# Altium project VOLTAGE_MEASURE_DC.PrjPCB
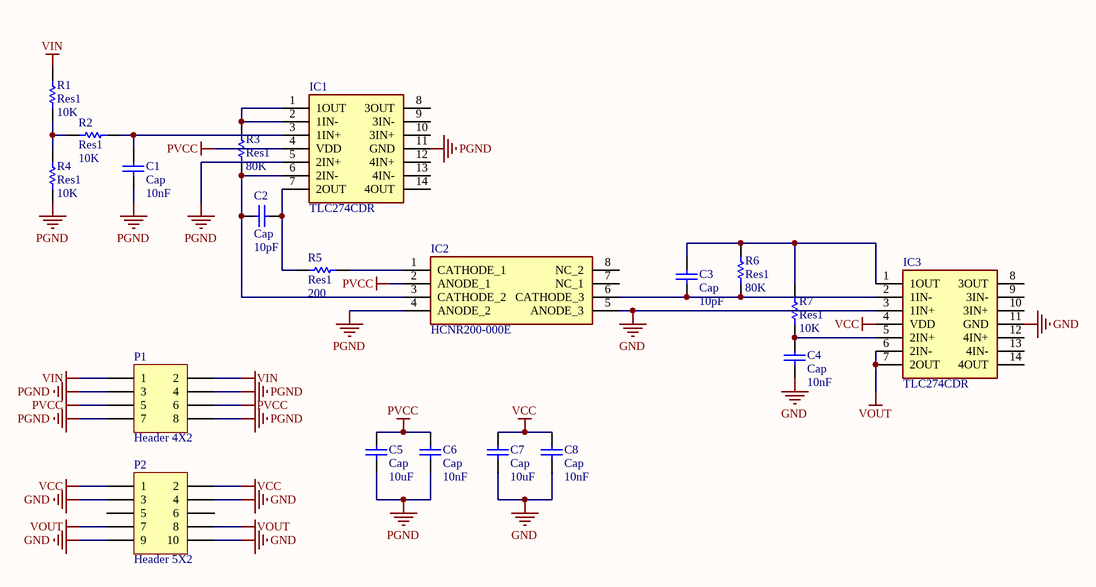
[diagram p0: VOLTAGE_MEASURE_DC.SchDoc]
1 sheet, 20 parts. Net scope: global (net labels, ports and power ports of the same name join across sheets).
Board file: VOLTAGE_MEASURE_DC.PcbDoc

## Sheet VOLTAGE_MEASURE_DC.SchDoc
size A4

### Parts
C1  Cap  value 10nF  [1608[0603]]
C2  Cap  value 10pF  [1608[0603]]
C3  Cap  value 10pF  [1608[0603]]
C4  Cap  value 10nF  [1608[0603]]
C5  Cap  value 10uF  [1608[0603]]
C6  Cap  value 10nF  [1608[0603]]
C7  Cap  value 10uF  [1608[0603]]
C8  Cap  value 10nF  [1608[0603]]
IC1  TLC274CDR  [SOIC127P600X175-14N]
IC2  HCNR200-000E  [DIP1100W56P254L1115H510Q8N]
IC3  TLC274CDR  [SOIC127P600X175-14N]
P1  Header 4X2  [HDR2X4]
P2  Header 5X2  [HDR2X5]
R1  Res1  value 10K  [J1-0603]
R2  Res1  value 10K  [J1-0603]
R3  Res1  value 80K  [J1-0603]
R4  Res1  value 10K  [J1-0603]
R5  Res1  value 200  [J1-0603]
R6  Res1  value 80K  [J1-0603]
R7  Res1  value 10K  [J1-0603]

### Nets
GND: C4.1 C7.2 C8.2 IC2.5(ANODE_3) IC3.3(1IN+) IC3.11(GND) P2.3 P2.4 P2.9 P2.10
PGND: C1.1 C5.2 C6.2 IC1.5(2IN+) IC1.11(GND) IC2.4(ANODE_2) P1.3 P1.4 P1.7 P1.8 R4.1
PVCC: C5.1 C6.1 IC1.4(VDD) IC2.2(ANODE_1) P1.5 P1.6
VCC: C7.1 C8.1 IC3.4(VDD) P2.1 P2.2
VIN: P1.1 P1.2 R1.2
VOUT: IC3.6(2IN-) IC3.7(2OUT) P2.7 P2.8
NetC1_2: C1.2 IC1.3(1IN+) R2.2
NetC2_1: C2.1 IC1.7(2OUT) R5.1
NetC2_2: C2.2 IC1.6(2IN-) IC2.3(CATHODE_2) R3.1
NetC3_1: C3.1 IC3.1(1OUT) R6.2 R7.1
NetC3_2: C3.2 IC2.6(CATHODE_3) IC3.2(1IN-) R6.1
NetC4_2: C4.2 IC3.5(2IN+) R7.2
NetIC1_1: IC1.1(1OUT) IC1.2(1IN-) R3.2
NetIC2_1: IC2.1(CATHODE_1) R5.2
NetR1_1: R1.1 R2.1 R4.2

Not connected (* = marked no-connect by the designer): IC1 8(3OUT) 9(3IN-) 10(3IN+) 12(4IN+) 13(4IN-) 14(4OUT); IC2 7(NC_1) 8(NC_2); IC3 8(3OUT) 9(3IN-) 10(3IN+) 12(4IN+) 13(4IN-) 14(4OUT); P2 5 6

### Library data of the parts
C1-C8 = Cap: Capacitor; Published: 8-Jun-2000; LatestRevisionDate: 17-Jul-2002; LatestRevisionNote: Re-released for DXP Platform.; PackageReference: RAD-0.3; Publisher: Altium Limited; PackageDescription: Radial Cap, Thru-Hole; 2 Leads; 0.3 in Pin Spacing
IC1 IC3 = TLC274CDR: Integrated Circuit; Manufacturer_Name: Texas Instruments; Datasheet Link: http://www.ti.com/lit/gpn/tlc274; Manufacturer_Part_Number: TLC274CDR; Mouser Part Number: 595-TLC274CDR; Mouser Price/Stock: https://www.mouser.com/Search/Refine.aspx?Keyword=595-TLC274CDR; RS Part Number: 0527237; RS Price/Stock: http://uk.rs-online.com/web/p/products/0527237
IC2 = HCNR200-000E: Integrated Circuit; Manufacturer_Name: Avago Technologies; Datasheet Link: https://docs.broadcom.com/docs/AV02-0886EN; Height: 5.1mm; Manufacturer_Part_Number: HCNR200-000E; Mouser Part Number: 630-HCNR200-000E; Mouser Price/Stock: https://www.mouser.com/Search/Refine.aspx?Keyword=630-HCNR200-000E; RS Part Number: 6961248P; RS Price/Stock: http://uk.rs-online.com/web/p/products/6961248P
P1 = Header 4X2: Header, 4-Pin, Dual row; LatestRevisionDate: 17-Jul-2002; LatestRevisionNote: Re-released for DXP Platform.; Publisher: Altium Limited
P2 = Header 5X2: Header, 5-Pin, Dual row; LatestRevisionDate: 17-Jul-2002; LatestRevisionNote: Re-released for DXP Platform.; Publisher: Altium Limited
R1-R7 = Res1: Resistor; Published: 8-Jun-2000; LatestRevisionDate: 17-Jul-2002; LatestRevisionNote: Re-released for DXP Platform.; PackageReference: AXIAL-0.3; Publisher: Altium Limited; PackageDescription: Axial Device, Thru-Hole; 2 Leads; 0.3 in Pin Spacing